# EAGLE design piezo-preamp-tickler_V2-RevG-Breakout (EAGLE 8.5.0)

## Sheet 1 of 2
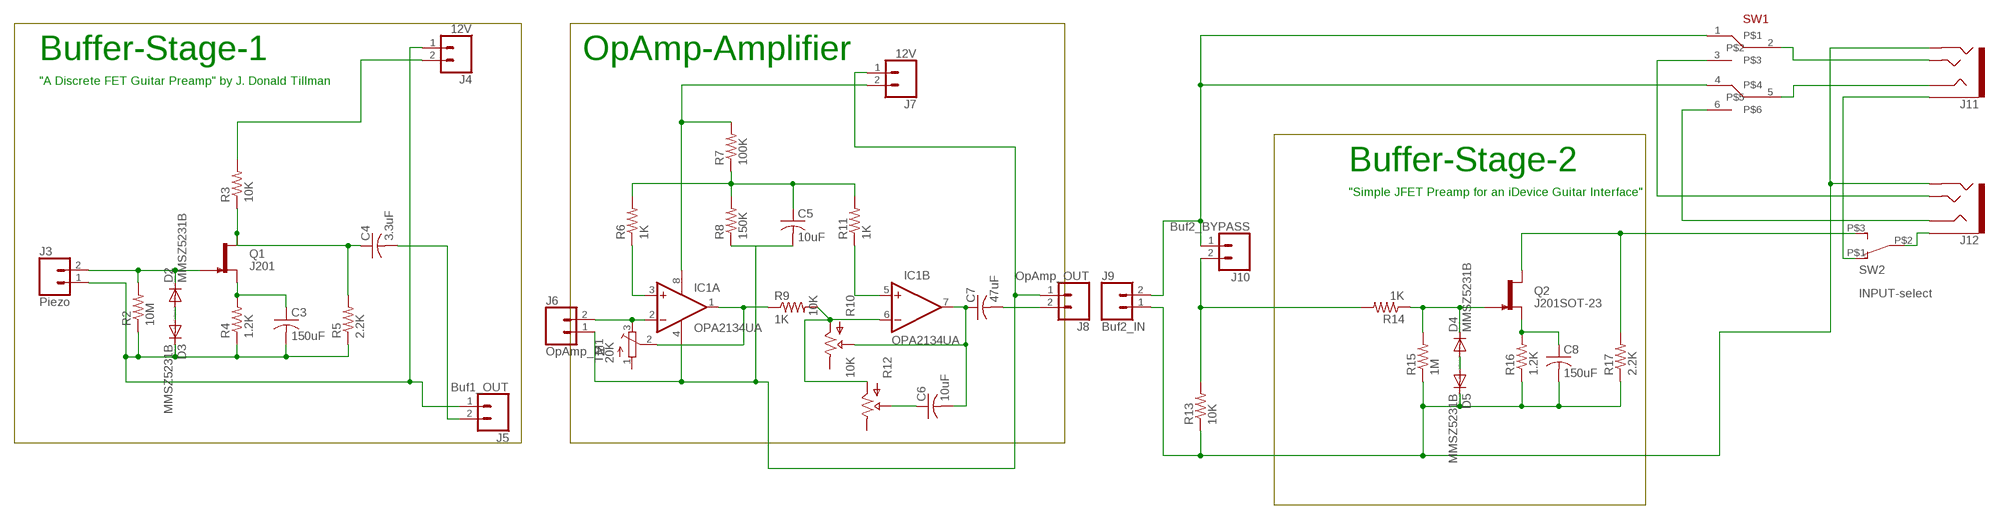
[diagram p0: schematic, sheet 1]

### Parts
C3  150uF  C-US  [CT7343]
C4  3.3uF  C-US  [CT7343]
C5  10uF  C-USC0805K  [C0805K]
C6  10uF  C-USC0805K  [C0805K]
C7  47uF  C-US  [CT7343]
C8  150uF  C-US  [CT7343]
D2  MMSZ5231B  DIODE-SOD123  [SOD123]
D3  MMSZ5231B  DIODE-SOD123  [SOD123]
D4  MMSZ5231B  DIODE-SOD123  [SOD123]
D5  MMSZ5231B  DIODE-SOD123  [SOD123]
IC1  OPA2134UA  [SO08]
J3  Piezo  CONN_02  [1X02]
J4  12V  CONN_02  [1X02]
J5  Buf1_OUT  CONN_02  [1X02]
J6  OpAmp_IN  CONN_02  [1X02]
J7  12V  CONN_02  [1X02]
J8  OpAmp_OUT  CONN_02  [1X02]
J9  Buf2_IN  CONN_02  [1X02]
J10  Buf2_BYPASS  CONN_02  [1X02]
J11  AUDIO-JACK3LGPADS  [AUDIO-JACK-TRRS-SMD]
J12  AUDIO-JACK3LGPADS  [AUDIO-JACK-TRRS-SMD]
Q1  J201  J201SOT-23  [SOT23-3]
Q2  J201SOT-23  [SOT23-3]
R2  10M  R-US_R0805  [R0805]
R3  10K  R-US_R0805  [R0805]
R4  1.2K  R-US_R0805  [R0805]
R5  2.2K  R-US_R0805  [R0805]
R6  1K  R-US_R0805  [R0805]
R7  100K  R-US_R0805  [R0805]
R8  150K  R-US_R0805  [R0805]
R9  1K  R-US_R0805  [R0805]
R10  10K  POTTHUMBPOT14  [THUMBPOT14]
R11  1K  R-US_R0805  [R0805]
R12  10K  POTTHUMBPOT14  [THUMBPOT14]
R13  10K  R-US_R0805  [R0805]
R14  1K  R-US_R0805  [R0805]
R15  1M  R-US_R0805  [R0805]
R16  1.2K  R-US_R0805  [R0805]
R17  2.2K  R-US_R0805  [R0805]
SW1  SWITCH_DPDT  [SWITCH_DPDT_CL-SB-22B]
SW2  INPUT-select  SWITCH_SPDTCL-SB-12B  [SWITCH_SPDT_CL-SB-12B]
TM1  20K  TRIMPOTTC33X  [TC33X]

### Nets
N$1: D4.A D5.A
N$2: D2.C J3.2 Q1.3(G) R2.2
N$3: C8.+ Q2.2(S) R16.2
N$5: IC1.5(B:+IN) R11.1
N$6: C6.2 C7.+ IC1.7(B:OUT) R10.P$2(WIPER)
N$7: IC1.6(B:-IN) R9.2 R10.P$1(IN) R12.P$1(IN)
N$8: D2.A D3.A
N$9: C4.+ Q1.1(D) R3.1 R5.2
N$10: D4.C Q2.3(G) R14.1 R15.2
N$11: J9.2 J10.1 SW1.1 SW1.4
N$12: J11.EARTH SW2.P$1
N$13: J11.TIP SW1.2
N$14: C3.+ Q1.2(S) R4.2
N$15: J11.RING1 SW1.5
N$17: J12.EARTH SW2.P$2
N$19: IC1.2(A:-IN) J6.2 TM1.3(E)
N$20: C3.- D3.C J3.1 J4.1 J5.1 R2.1 R4.1 R5.1
N$22: IC1.3(A:+IN) R6.1
N$23: C5.1 R6.2 R7.1 R8.2 R11.2
N$24: IC1.1(A:OUT) R9.1 TM1.2(S)
N$25: J4.2 R3.2
N$26: J12.RING1 SW1.6
N$27: J12.TIP SW1.3
N$28: C4.- J5.2
N$31: C6.1 R12.P$2(WIPER)
N$36: C7.- J8.2
N$42: IC1.8(A:V+) J7.2 R7.2
N$44: C5.2 IC1.4(A:V-) J6.1 J7.1 J8.1 R8.1
N$45: C8.- D5.C J9.1 J11.RING2 J12.RING2 R13.1 R15.1 R16.1 R17.1
N$46: J10.2 R13.2 R14.2
SELECT: Q2.1(D) R17.2 SW2.P$3
Unconnected: R10.P$3(OUT) R12.P$3(OUT) TM1.1(A)

### Notes on the sheet
- Buffer-Stage-1 | OpAmp-Amplifier
- "A Discrete FET Guitar Preamp" by J. Donald Tillman
- Buffer-Stage-2
- "Simple JFET Preamp for an iDevice Guitar Interface"

## Sheet 2 of 2
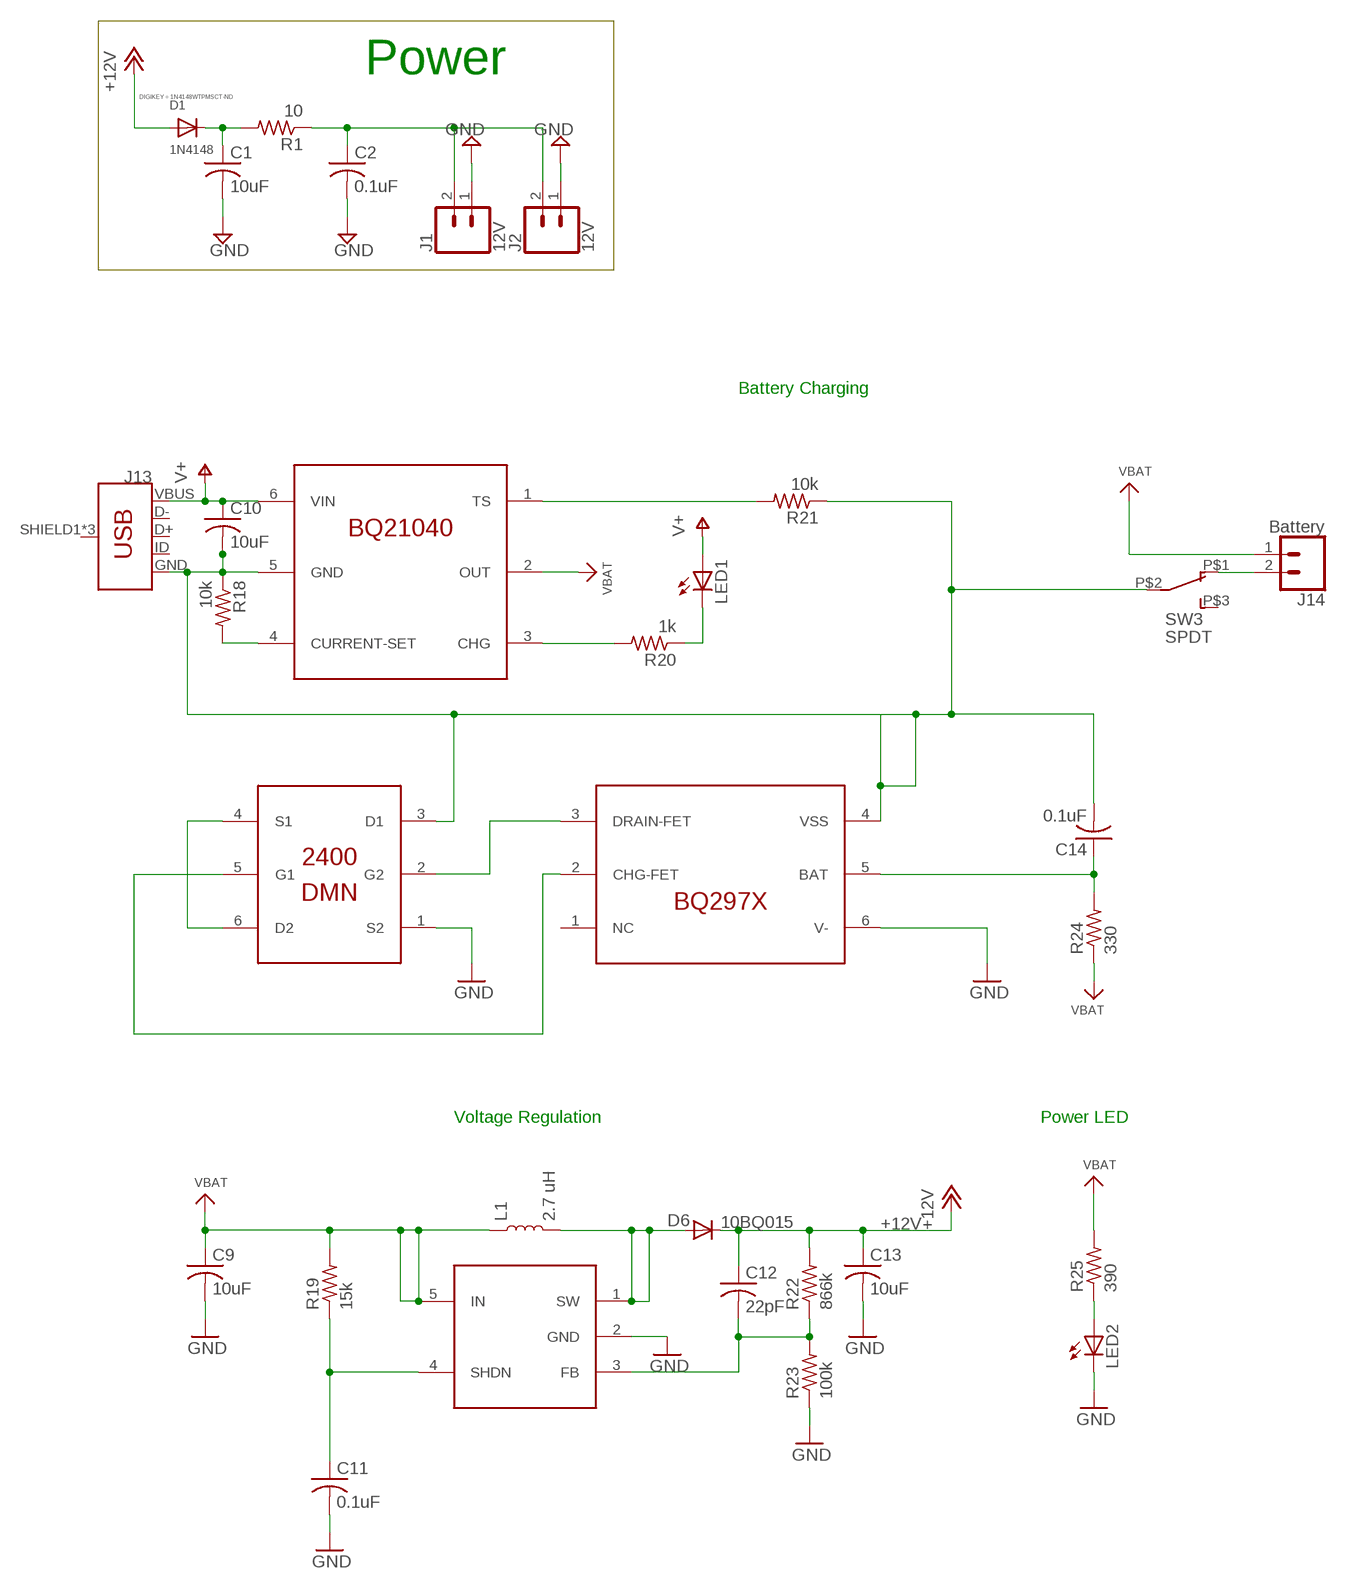
[diagram p1: schematic, sheet 2]

### Parts
C1  10uF  C-USC0805K  [C0805K]
C2  0.1uF  C-USC0805K  [C0805K]
C9  10uF  C-USC0805K  [C0805K]
C10  10uF  C-USC0805K  [C0805K]
C11  0.1uF  C-USC0805K  [C0805K]
C12  22pF  C-USC0805K  [C0805K]
C13  10uF  C-USC0805K  [C0805K]
C14  0.1uF  C-USC0805K  [C0805K]
D1  1N4148  DIODESOD-123  [SOD-123]
D6  10BQ015  DIODESMA  [SMA-DIODE]
J1  12V  CONN_02  [1X02]
J2  12V  CONN_02  [1X02]
J13  USB_MICRO-BREDUCED_PASTE  [USB-B-MICRO-SMD_RED_PASTE]
J14  Battery  CONN_02LOCK  [1X02_LOCK]
L1  2.7 uH  INDUCTOR-CR54-3.3UH  [CR54]
LED1  LED3MM  [LED3MM]
LED2  LED3MM  [LED3MM]
Q3  DMN2400  DUAL-NFET-DMN2400  [SOT-563]
Q4  BQ21040  BQ21040-LIPO-CHARGER  [SOT23-6]
Q5  SC4503  [SOT23-5]
Q6  BQ297X  BQ297X-BATTERY-MANAGER  [WSON-6]
R1  10  R-US_R0805  [R0805]
R18  10k  R-US_R0805  [R0805]
R19  15k  R-US_R0805  [R0805]
R20  1k  R-US_R0805  [R0805]
R21  10k  R-US_R0805  [R0805]
R22  866k  R-US_R0805  [R0805]
R23  100k  R-US_R0805  [R0805]
R24  330  R-US_R0805  [R0805]
R25  390  R-US_R0805  [R0805]
SW3  SPDT  SWITCH_SPDTCL-SB-12B  [SWITCH_SPDT_CL-SB-12B]

### Nets
+12V: C12.1 C13.1 D1.A D6.C R22.2
GND: C1.2 C2.2 C9.2 C11.2 C13.2 J1.1 J2.1 LED2.K(C) Q3.1(S2) Q5.2(GND) Q6.6(V-) R23.1
GND1: C10.2 C14.2 J13.GND Q3.3(D1) Q4.5(GND) Q6.4(VSS) R18.1 R21.1 SW3.P$2
N$16: C1.1 D1.C R1.2
N$18: LED2.A R25.1
N$21: J14.2 SW3.P$1
N$29: C11.1 Q5.4(SHDN) R19.1
N$30: C12.2 Q5.3(FB) R22.1 R23.2
N$32: D6.A L1.P$2 Q5.1(SW)
N$33: Q4.3(CHG) R20.2
N$34: C14.1 Q6.5(BAT) R24.2
N$35: Q4.1(TS) R21.2
N$37: Q3.4(S1) Q3.6(D2)
N$38: Q4.4(CURRENT-SET) R18.2
N$39: Q3.5(G1) Q6.2(CHG-FET)
N$40: LED1.K(C) R20.1
N$41: Q3.2(G2) Q6.3(DRAIN-FET)
N$43: C2.1 J1.2 J2.2 R1.1
V+: C10.1 J13.VBUS LED1.A Q4.6(VIN)
VBAT: C9.1 J14.1 L1.P$1 Q4.2(OUT) Q5.5(IN) R19.2 R24.1 R25.2
Unconnected: J13.D+ J13.D- J13.ID J13.SHIELD1(SHIELD) J13.SHIELD2(SHIELD) J13.SHIELD3(SHIELD) Q6.1(NC) SW3.P$3

### Notes on the sheet
- Power
- Battery Charging
- Voltage Regulation | Power LED

## Library data of the parts
C1-C14 = adafruit:C-US: CAPACITOR, American symbol
D1 = adafruit:DIODE: Diode; DIGIKEY: 1N4148WTPMSCT-ND
D2-D5 = diode:DIODE-: DIODE
D6 = SparkFun:DIODE: Diode
IC1 = linear:OPA2*: Dual Operational Amplifier Low Power, Single-Supply, Rail-To-Rail Operational Amplifier Source: http://focus.ti.com/lit/ds/symlink/opa2345.pdf http://focus.ti.com .. opa241.pdf http://focus.ti.com/lit/ds/symlink/opa2134.pdf
J1-J10 J14 = SparkFun-Connectors:CONN_02: Multi connection point. Often used as Generic Header-pin footprint for 0.1 inch spaced/style header connections On any of the 0.1 inch spaced packages, you can populate with these: Break Away Headers - Straight <https://www.sparkfun.com/products/116> (PRT-00116) Break Away Male Headers - Right Angle <https://www.sparkfun.com/products/553> (PRT-00553) Female Headers <https://www.sparkfun.com/products/115> (PRT-00115) Break Away Headers - Machine Pin <https://www.sparkfun.com/products/117> (PRT-00117) Break Away Female Headers - Swiss Machine Pin <https://www.sparkfun.com/products/743> (PRT-00743) For SCREWTERMINALS and SPRING TERMINALS visit here: Screw Terimnals on SparkFun.com <https://www.sparkfun.com/search/results?term=Screw+Terminals> (5mm/3.5mm/2.54mm spacing) This device is also useful as a general connection point to wire up your design to another part of your project. Our various solder wires solder well into these plated through hole pads. Hook-Up Wire - Assortment (Stranded, 22 AWG) <https://www.sparkfun.com/products/11375> (PRT-11375) Hook-Up Wire - Assortment (Solid Core, 22 AWG) <https://www.sparkfun.com/products/11367> (PRT-11367) View the entire wire category on our website here <https://www.sparkfun.com/categories/141> Special notes: Molex polarized connector foot print use with: PRT-08233 with associated crimp pins and housings. 2.54_SCREWTERM for use with PRT-10571. 3.5mm Screw Terminal footprints for PRT-08084 5mm Screw Terminal footprints for use with PRT-08432
J11 J12 = Daniel:AUDIO-JACK3: Audio jack - 3.5mm TRRS variety - two rings.
J13 = SparkFun-Connectors:USB_MICRO-B: USB Type Micro-B Connector Male/female and PTH/SMT variants SparkFun Products: SparkFun microB USB Breakout <https://www.sparkfun.com/products/12035> SparkFun USB microB Plug Breakout <https://www.sparkfun.com/products/10031> SparkFun ESP8266 Thing <https://www.sparkfun.com/products/13231>; PROD_ID: CONN-11752
L1 = SparkFun-Coils:INDUCTOR: Inductors Resist changes in electrical current. Basically a coil of wire. SparkFun Products: SparkFun Load Cell Amplifier - HX711 <https://www.sparkfun.com/products/13879> IOIO-OTG - V2.2 <https://www.sparkfun.com/products/13613>; PROD_ID: NDUC-11157; VALUE: 3.3µH/±30%/3.4A
LED1 LED2 = led:LED: LED OSRAM: - CHIPLED LG R971, LG N971, LY N971, LG Q971, LY Q971, LO R971, LY R971 LH N974, LH R974 LS Q976, LO Q976, LY Q976 LO Q996 - Hyper CHIPLED LW Q18S LB Q993, LB Q99A, LB R99A - SideLED LS A670, LO A670, LY A670, LG A670, LP A670 LB A673, LV A673, LT A673, LW A673 LH A674 LY A675 LS A676, LA A676, LO A676, LY A676, LW A676 LS A679, LY A679, LG A679 - Hyper Micro SIDELED® LS Y876, LA Y876, LO Y876, LY Y876 LT Y87S - SmartLED LW L88C, LW L88S LB L89C, LB L89S, LG L890 LS L89K, LO L89K, LY L89K LS L896, LA L896, LO L896, LY L896 - TOPLED LS T670, LO T670, LY T670, LG T670, LP T670 LSG T670, LSP T670, LSY T670, LOP T670, LYG T670 LG T671, LOG T671, LSG T671 LB T673, LV T673, LT T673, LW T673 LH T674 LS T676, LA T676, LO T676, LY T676, LB T676, LH T676, LSB T676, LW T676 LB T67C, LV T67C, LT T67C, LS T67K, LO T67K, LY T67K, LW E67C LS E67B, LA E67B, LO E67B, LY E67B, LB E67C, LV E67C, LT E67C LW T67C LS T679, LY T679, LG T679 LS T770, LO T770, LY T770, LG T770, LP T770 LB T773, LV T773, LT T773, LW T773 LH T774 LS E675, LA E675, LY E675, LS T675 LS T776, LA T776, LO T776, LY T776, LB T776 LHGB T686 LT T68C, LB T68C - Hyper Mini TOPLED® LB M676 - Mini TOPLED Santana® LG M470 LS M47K, LO M47K, LY M47K Source: http://www.osram.convergy.de LUXEON: - LUMILED® LXK2-PW12-R00, LXK2-PW12-S00, LXK2-PW14-U00, LXK2-PW14-V00 LXK2-PM12-R00, LXK2-PM12-S00, LXK2-PM14-U00 LXK2-PE12-Q00, LXK2-PE12-R00, LXK2-PE12-S00, LXK2-PE14-T00, LXK2-PE14-U00 LXK2-PB12-K00, LXK2-PB12-L00, LXK2-PB12-M00, LXK2-PB14-N00, LXK2-PB14-P00, LXK2-PB14-Q00 LXK2-PR12-L00, LXK2-PR12-M00, LXK2-PR14-Q00, LXK2-PR14-R00 LXK2-PD12-Q00, LXK2-PD12-R00, LXK2-PD12-S00 LXK2-PH12-R00, LXK2-PH12-S00 LXK2-PL12-P00, LXK2-PL12-Q00, LXK2-PL12-R00 Source: www.luxeon.com KINGBRIGHT: KA-3528ASYC Source: www.kingbright.com
Q1 Q2 = CMU-ArtFab:J201: N-channel JFET
Q3 = CMU-ArtFab:DUAL-NFET-DMN2400
Q4 = CMU-ArtFab:BQ21040-LIPO-CHARGER
Q5 = CMU-ArtFab:SC4503
Q6 = CMU-ArtFab:BQ297X-BATTERY-MANAGER
R1-R9 R11 R13-R25 = CMU-ArtFab:R-US_: RESISTOR, American symbol
R10 R12 = CMU-ArtFab:POT: http://www.taydaelectronics.com/10k-ohm-linear-taper-potentiometer-round-shaft-pcb-9mm.html http://www.taydaelectronics.com/datasheets/A-1847.pdf
SW1 = CMU-ArtFab:SWITCH_DPDT
SW2 SW3 = CMU-ArtFab:SWITCH_SPDT
TM1 = adafruit:TRIMPOT: SMT trimmer potentiometer part number TC33X http://www.ladyada.net/library/eagle

## Board
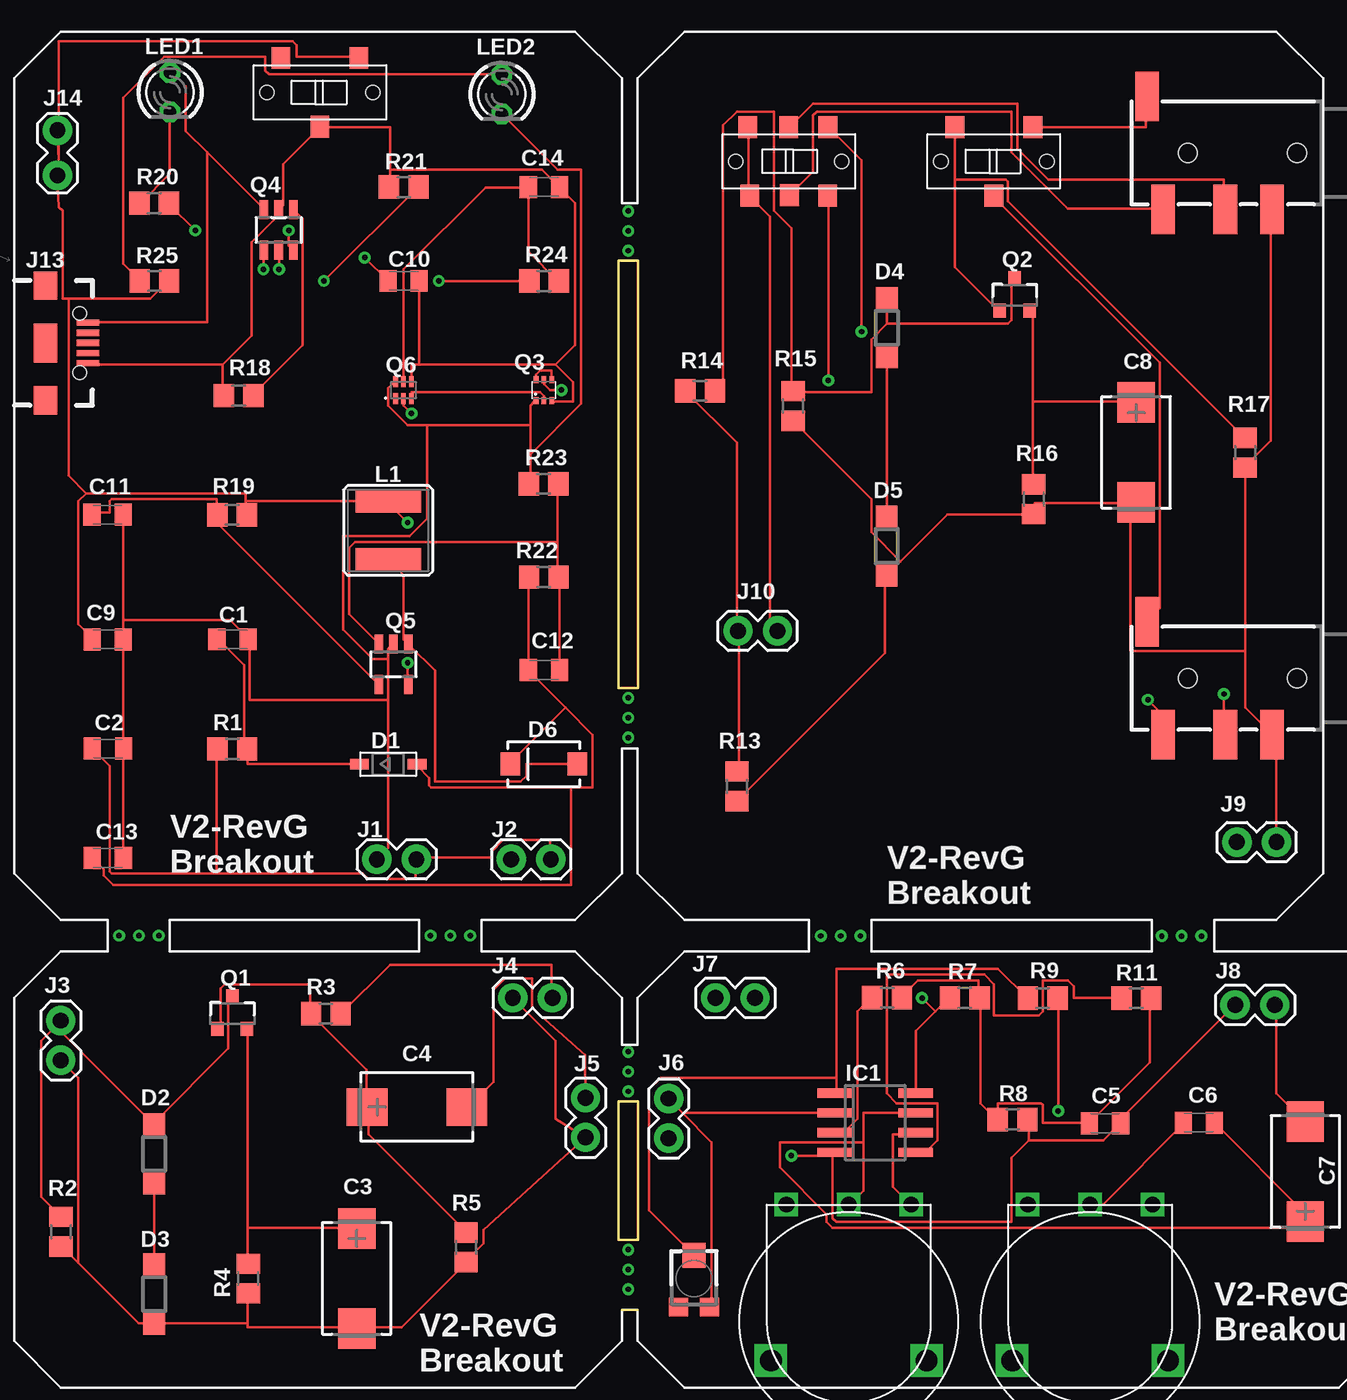
[diagram p2: board, top side]
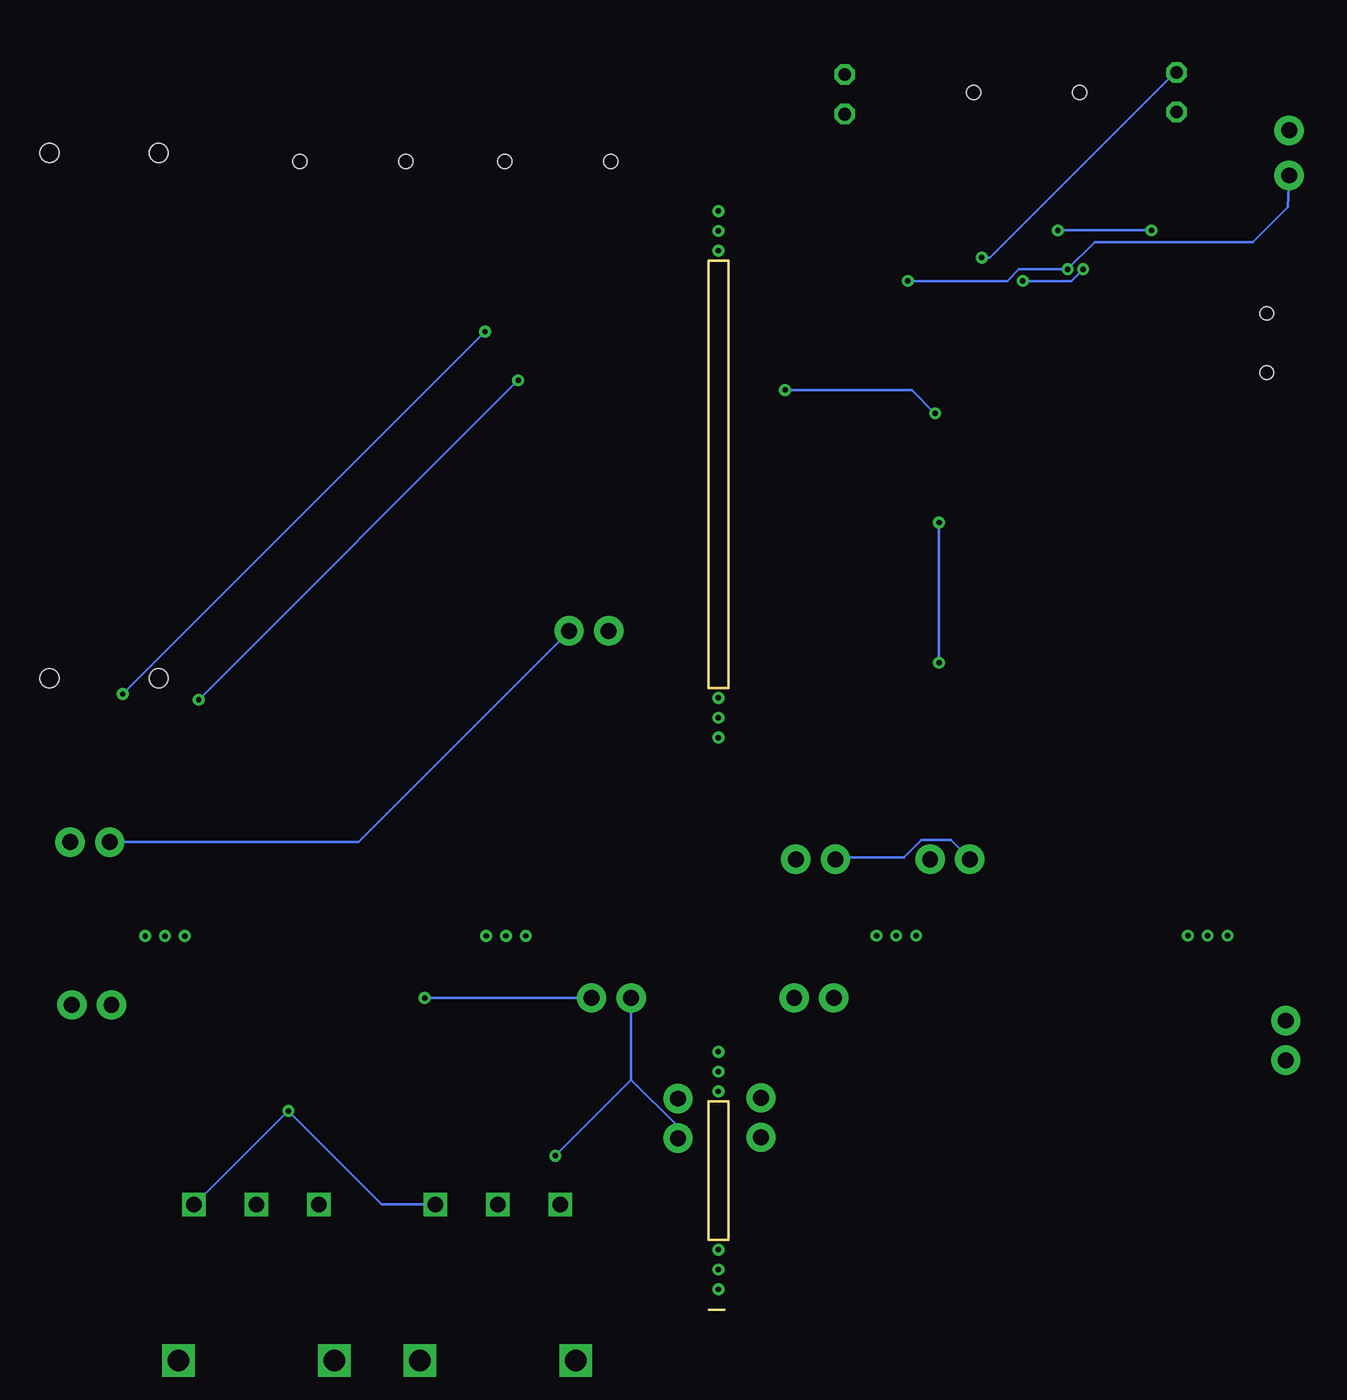
[diagram p3: board, bottom side, seen from below]

Size 1.27 x 67.32 mm. Coordinates in mm from the lower left corner, seen from the top.
Outline: 0.23,0 1.23,0.01
Outline: 0,67.32 1.27,67.32 1.27,39.89 0,39.89 0,67.32
Outline: 0,13.38 1.27,13.38 1.27,4.49 0,4.49 0,13.38
Copper layers (1*16): Top 0.035mm / dielectric 1.5mm / Bottom 0.035mm
Design rules "default *": minimum track width 6mil, minimum drill 0.35mm, track to track 8mil, track to pad 8mil, pad to pad 8mil, via to via 8mil, smd to smd 8mil, copper to edge 8mil, drill to drill 6mil, minimum pad ring 10mil, minimum via ring 8mil, stop-mask expansion 4mil, vias tented up to drill 20mil, thermal gap 10mil

### Footprints (pad centres in the part's own frame; a part is rotated, then mirrored left to right if it is on the bottom)
C0805K = smd 1.1 x 1.4: 1 -1,0; 2 1,0
CT7343 = smd 2.6 x 2.4: + 3.2,0; - -3.2,0
SOD-123 = smd 1.2 x 0.7: A 1.85,0; C -1.85,0
SOD123 = smd 1.4 x 1.4: A 1.9,0; C -1.9,0
SMA-DIODE = smd 1.27 x 1.47: A -2.15,0; C 2.15,0
SO08 = smd 0.6 x 2.2: 1 -1.905,-2.6; 2 -0.635,-2.6; 3 0.635,-2.6; 4 1.905,-2.6; 5 1.905,2.6; 6 0.635,2.6; 7 -0.635,2.6; 8 -1.905,2.6
1X02 = drill 1.016 pad 1.88: 1 0,0; 2 2.54,0
AUDIO-JACK-TRRS-SMD = smd 1.524 x 3.175: EARTH 11.227,-3.619; RING1 6.2,3.619; RING2 3.2,3.619; TIP 10.2,3.619 | hole 1.2: 1.6,0; 8.6,0
USB-B-MICRO-SMD_RED_PASTE = smd 1.45 x 0.4: D+ 2.725,0; D- 2.725,0.65; GND 2.725,-1.3; ID 2.725,-0.65; VBUS 2.725,1.3 | smd 1.5 x 1.8: SHIELD1 0,3.685; SHIELD2 0,-3.685 | smd 1.5 x 2.5: SHIELD3 0,0 | hole 0.85: 2.2,1.9; 2.2,-1.9
1X02_LOCK = drill 1.016 pad 1.88: 1 -0.178,0; 2 2.718,0
CR54 = smd 4.2 x 1.4: P$1 0,1.85; P$2 0,-1.85
LED3MM = drill 0.813 octagon: A -1.27,0; K 1.27,0
SOT23-3 = smd 0.8 x 0.9: 1 -0.95,-1; 2 0.95,-1; 3 0,1.1
SOT-563 = smd 0.3 x 0.45: 1 -0.5,-0.675; 2 0,-0.675; 3 0.5,-0.675; 4 0.5,0.675; 5 0,0.675; 6 -0.5,0.675
SOT23-6 = smd 0.55 x 1.2: 1 -0.95,-1.3; 2 0,-1.3; 3 0.95,-1.3; 4 0.95,1.3; 5 0,1.3; 6 -0.95,1.3
SOT23-5 = smd 0.55 x 1.2: 1 -0.95,-1.3; 2 0,-1.3; 3 0.95,-1.3; 4 0.95,1.3; 5 -0.95,1.3
WSON-6 = smd 0.3 x 0.7: 1 -0.5,-0.55; 2 0,-0.55; 3 0.5,-0.55; 4 0.5,0.55; 5 0,0.55; 6 -0.5,0.55
R0805 = smd 1.3 x 1.5: 1 -0.95,0; 2 0.95,0
THUMBPOT14 = drill 1 square: P$1 -4,-7.5; P$2 0,-7.5; P$3 4,-7.5 | drill 1.4 square: P$4 -5,2.5; P$5 5,2.5
SWITCH_DPDT_CL-SB-22B = smd 1.2 x 1.4: 1 -2.5,-2.2; 2 0.05,-2.17; 3 2.5,-2.2; 4 -2.63,2.2; 5 0,2.2; 6 2.51,2.2 | hole 0.9: -3.4,0; 3.4,0
SWITCH_SPDT_CL-SB-12B = smd 1.2 x 1.4: P$1 -2.5,-2.2; P$2 0,2.2; P$3 2.5,-2.2 | hole 0.9: -3.4,0; 3.4,0
TC33X = smd 1.2 x 1.2: 1 -1,-1.825; 3 1,-1.825 | smd 1.5 x 1.6: 2 0,1.5

### Placement (x,y rotation side)
C1  -24.76,43.02 0 top  (outside the outline)
C2  -32.75,36 0 top  (outside the outline)
C3  -16.78,2.01 90 top  (outside the outline)
C4  -12.92,13.01 180 top  (outside the outline)
C5  31.23,11.96 0 top  (outside the outline)
C6  37.24,12 0 top  (outside the outline)
C7  44.07,8.88 270 top  (outside the outline)
C8  33.23,55.01 90 top  (outside the outline)
C9  -32.77,43.02 0 top  (outside the outline)
C10  -13.78,66.02 0 top  (outside the outline)
C11  -32.78,51.02 0 top  (outside the outline)
C12  -4.78,41.04 0 top  (outside the outline)
C13  -32.76,28.99 0 top  (outside the outline)
C14  -4.78,72.04 0 top  (outside the outline)
D1  -14.77,35 0 top  (outside the outline)
D2  -29.78,10.01 270 top  (outside the outline)
D3  -29.77,1.01 90 top  (outside the outline)
D4  17.23,63 270 top  (outside the outline)
D5  17.22,49 90 top  (outside the outline)
D6  -4.78,35.01 180 top
IC1  16.47,12.01 270 top  (outside the outline)
J1  -15.5,28.91 0 top  (outside the outline)
J2  -6.88,28.91 0 top  (outside the outline)
J3  -35.77,16.01 90 top  (outside the outline)
J4  -6.77,20.01 0 top  (outside the outline)
J5  -2.1,11.06 90 top
J6  3.23,11.01 90 top
J7  6.23,20.01 0 top  (outside the outline)
J8  39.58,19.56 0 top  (outside the outline)
J9  42.23,30.01 180 top  (outside the outline)
J10  10.21,43.56 180 top  (outside the outline)
J11  45.15,74.23 180 top  (outside the outline)
J12  45.15,40.52 180 top  (outside the outline)
J13  -36.76,62.04 0 top  (outside the outline)
J14  -35.98,72.95 90 top  (outside the outline)
L1  -14.77,50.01 0 top  (outside the outline)
LED1  -28.77,78.12 270 top  (outside the outline)
LED2  -7.48,77.98 270 top  (outside the outline)
Q1  -24.77,19.01 0 top  (outside the outline)
Q2  25.42,65.09 0 top  (outside the outline)
Q3  -4.78,59 0 top  (outside the outline)
Q4  -21.8,69.29 0 top  (outside the outline)
Q5  -14.43,41.41 180 top  (outside the outline)
Q6  -13.79,59 0 top  (outside the outline)
R1  -24.77,35.98 0 top  (outside the outline)
R2  -35.76,5.01 90 top  (outside the outline)
R3  -18.76,19 0 top  (outside the outline)
R4  -23.74,2 90 top  (outside the outline)
R5  -9.77,4.01 90 top  (outside the outline)
R6  17.24,20.03 0 top  (outside the outline)
R7  22.22,20.01 180 top  (outside the outline)
R8  25.29,12.21 180 top  (outside the outline)
R9  27.23,20 0 top  (outside the outline)
R10  14.78,-0.75 180 top  (outside the outline)
R11  33.23,20 0 top  (outside the outline)
R12  30.27,-0.75 180 top  (outside the outline)
R13  7.61,33.59 90 top  (outside the outline)
R14  5.25,58.96 180 top  (outside the outline)
R15  11.21,57.99 90 top  (outside the outline)
R16  26.66,52.01 90 top  (outside the outline)
R17  40.22,54.99 90 top  (outside the outline)
R18  -24.36,58.66 0 top  (outside the outline)
R19  -24.78,51 0 top  (outside the outline)
R20  -29.78,71.01 0 top  (outside the outline)
R21  -13.77,72.04 0 top  (outside the outline)
R22  -4.79,47.02 180 top  (outside the outline)
R23  -4.8,52.99 0 top  (outside the outline)
R24  -4.77,66.01 0 top  (outside the outline)
R25  -29.77,66.02 0 top  (outside the outline)
SW1  10.93,73.69 0 top  (outside the outline)
SW2  24.09,73.69 180 top  (outside the outline)
SW3  -19.15,78.12 180 top  (outside the outline)
TM1  4.85,2 0 top

### Tracks (layer width: path | path; a pad name or v marks a point on that pad's centre or on a via)
+12V
  Top 0.152: -3.02,33.51 -1.65,33.51 -1.65,36.88 -3.4,38.63 | -3.02,33.51 -12.02,33.51 -12.15,33.63 -12.15,34.13 -12.9,34.88 D1.A | -3.4,38.63 -5.77,41.01 C12.1 -5.77,41.13 -5.77,47.01 R22.2 | C13.1 -33.02,28.26 -33.02,27.88 -32.4,27.26 -3.02,27.26 -3.02,33.51 | -3.4,38.63 -6.9,35.13 D6.C
GND
  Top 0.152: -5.65,54.88 -5.65,53.01 R23.1 | -5.65,54.88 -5.65,56.76 | -5.65,56.76 -5.65,58.01 -5.4,58.26 Q3.1 | -5.65,56.76 -12.27,56.76 | -12.27,56.76 -13.52,56.76 -14.77,58.01 -14.77,59.13 -14.4,59.51 Q6.6 | LED2.K -3.9,73.14 -2.4,73.14 -2.4,58.13 -5.65,54.88 | -14.77,39.13 -14.77,29.63 -15.4,29.01 J1.1 | -14.77,39.13 -14.77,41.76 | -14.77,41.76 -14.77,42.38 -14.52,42.63 Q5.2 | C13.2 -31.77,29.01 -31.77,35.88 C2.2 -31.77,36.01 C9.2 -31.77,43.13 -31.77,44.26 | -31.77,44.26 C11.2 | -31.77,44.26 -24.9,44.26 -23.77,43.13 C1.2 -23.65,43.01 -23.65,39.13 -14.77,39.13 | -12.27,56.76 -12.27,50.76 -13.4,49.63 -17.65,49.63 -17.65,43.63 -15.77,41.76 -14.77,41.76
  Bottom 0.152: J2.1 -6.9,29.01 -11.27,29.01 -12.4,30.13 -14.27,30.13 -15.4,29.01 J1.1
GND1
  Top 0.152: -4.02,60.63 -2.9,59.51 -2.9,58.26 -4.27,58.26 Q3.3 | -12.77,60.63 -13.27,60.63 -13.27,59.63 Q6.4 | -12.77,60.63 -4.02,60.63 | -12.77,60.63 C10.2 | -25.4,60.63 -34.02,60.63 J13.GND | -25.4,60.63 -25.4,58.76 R18.1 | -19.15,75.89 -21.52,73.51 -21.52,70.89 -21.77,70.64 Q4.5 -21.9,70.51 -21.9,70.14 -23.52,68.51 -23.52,62.51 -25.4,60.63 | -14.65,73.14 -4.9,73.14 -3.9,72.14 C14.2 -3.77,72.01 -2.77,71.01 -2.77,61.88 -4.02,60.63 | -14.65,73.14 -14.65,72.14 R21.1 | -19.15,75.89 -14.65,75.89 -14.65,73.14 | -19.15,75.89 SW3.P$2
N$1
  Top 0.152: D5.A 17.23,51.01 17.23,61.01 D4.A
N$2
  Top 0.152: Q1.3 -24.9,20.01 -25.02,19.88 -25.02,16.76 -29.77,12.01 D2.C -29.9,12.01 -36.02,18.13 -36.02,18.26 | -36.02,18.26 -35.77,18.51 J3.2 -36.02,18.26 | -36.02,18.26 -37.02,17.26 -37.02,7.26 -35.77,6.01 R2.2
N$3
  Top 0.152: 26.6,58.26 26.6,53.01 R16.2 | 26.6,58.26 26.6,63.88 26.48,64.01 Q2.2 | 26.6,58.26 33.23,58.26 C8.+
N$5
  Top 0.152: R11.1 32.23,20.01 29.23,20.01 29.23,20.76 28.85,21.13 27.23,21.13 27.23,19.13 26.98,18.88 24.1,18.88 24.1,20.88 23.48,21.51 17.23,21.51 17.23,13.88 17.85,13.26 20.48,13.26 20.48,10.88 19.73,10.13 19.1,10.13 IC1.5
N$6
  Top 0.152: 15.73,10.76 15.73,7.63 14.85,6.76 R10.P$2 | 15.73,10.76 15.73,12.63 18.98,12.63 IC1.7 | C6.2 38.35,11.88 43.98,6.26 43.98,5.76 C7.+ 43.98,5.63 43.98,5.26 13.73,5.26 13.35,5.63 13.35,6.13 10.35,9.13 10.35,10.76 15.73,10.76
N$7  (via drill 0.35)
  Top 0.152: IC1.6 18.98,11.26 17.6,11.26 17.6,7.88 18.73,6.76 R10.P$1 | v28.23,12.76 28.23,19.88 R9.2
  Bottom 0.152: R12.P$1 34.23,6.76 v28.23,12.76 22.23,6.76 18.85,6.76 R10.P$1
N$8
  Top 0.152: D3.A -29.77,8.01 D2.A
N$9
  Top 0.152: Q1.1 -25.65,18.13 -25.52,18.26 -25.52,20.63 -25.27,20.88 -19.77,20.88 -19.77,19.01 R3.1 -19.65,18.88 -16.15,15.38 -16.15,13.01 C4.+ -16.02,12.88 -16.02,11.26 -9.77,5.01 R5.2
N$10
  Top 0.152: 17.23,63.26 24.98,63.26 25.23,63.51 25.23,66.01 25.35,66.14 Q2.3 | 17.23,63.26 17.23,64.89 D4.C | 17.23,63.26 16.23,62.26 16.23,58.88 11.23,58.88 R15.2 11.1,59.01 11.1,69.39 9.98,70.51 9.98,76.89 7.6,76.89 6.73,76.01 6.73,59.51 6.23,59.01 R14.1
N$11
  Top 0.152: SW1.4 8.35,75.89 8.35,71.51 SW1.1 8.48,71.39 9.73,70.14 9.73,44.01 10.1,43.63 J10.1
  Bottom 0.152: J9.2 23.73,30.01 10.23,43.51 J10.1
N$12
  Top 0.152: SW2.P$1 33.85,75.89 33.85,77.76 J11.EARTH
N$13
  Top 0.152: SW1.2 12.48,73.01 12.48,76.64 12.73,76.89 25.23,76.89 25.23,74.26 28.85,70.64 34.85,70.64 J11.TIP
N$14
  Top 0.152: -23.77,5.26 -23.77,3.01 R4.2 | -23.77,5.26 -23.77,18.01 Q1.2 | -23.77,5.26 -16.9,5.26 C3.+
N$15
  Top 0.152: SW1.5 10.98,75.89 12.48,77.39 25.6,77.39 25.6,74.51 27.6,72.51 38.85,72.51 38.85,70.64 J11.RING1
N$16
  Top 0.152: D1.C -16.65,35.01 -23.77,35.01 -23.77,35.88 R1.2 -23.9,36.01 -24.02,36.13 -24.02,41.38 -25.65,43.01 C1.1
N$17
  Top 0.152: SW2.P$2 24.1,71.39 34.73,60.76 34.73,45.01 33.98,44.26 J12.EARTH
N$18
  Top 0.152: R25.1 -30.77,66.14 -31.77,67.14 -31.77,77.76 -29.15,80.39 -22.65,80.39 -22.65,79.51 -22.4,79.26 -7.52,79.26 LED2.A
N$19
  Top 0.152: 4.1,12.63 3.23,13.51 J6.2 | 4.1,12.63 5.98,10.76 5.98,0.38 5.85,0.26 TM1.3 | 4.1,12.63 13.85,12.63 IC1.2
N$20
  Top 0.152: J4.1 -4.02,17.26 -4.02,12.26 J5.1 -8.65,5.13 -8.65,4.26 -9.77,3.13 R5.1 -9.77,3.01 -13.9,-1.12 -16.77,-1.12 C3.- -16.9,-1.12 -23.77,-1.12 -23.77,-0.87 | -23.77,-0.87 -29.77,-0.87 | -23.77,-0.87 -23.77,1.01 R4.1 | -34.65,3.01 -30.77,-0.87 -29.77,-0.87 | -34.65,3.01 -35.65,4.01 R2.1 | -29.77,-0.87 D3.C | J3.1 -34.65,14.88 -34.65,3.01
N$21
  Top 0.152: SW3.P$1 -16.65,80.39 -20.65,80.39 -20.65,81.14 -20.9,81.39 -35.9,81.39 -35.9,73.76 J14.2
N$22
  Top 0.152: R6.1 16.23,20.01 15.35,19.13 15.35,12.26 14.48,11.38 13.98,11.38 IC1.3
N$23
  Top 0.152: R11.2 34.1,19.88 34.1,15.88 30.23,12.01 C5.1 30.1,12.01 27.23,12.01 27.23,13.13 27.1,13.26 24.35,13.26 24.35,12.26 R8.2 24.23,12.26 23.23,13.26 23.23,20.01 R7.1 23.1,20.13 23.1,21.13 19.23,21.13 18.23,20.13 R6.2
N$24
  Top 0.152: 13.98,14.88 13.98,14.01 IC1.1 | 13.98,14.88 13.98,21.88 24.35,21.88 26.23,20.01 R9.1 | 13.98,14.88 2.73,14.88 1.98,14.13 1.98,6.38 TM1.2
N$25
  Top 0.152: R3.2 -17.77,19.01 -14.65,22.13 -4.27,22.13 -4.27,20.01 J4.2
N$26  (via drill 0.35)
  Top 0.152: v15.6,62.76 15.6,73.76 13.48,75.89 SW1.6 | v38.85,39.51 38.85,37.01 J12.RING1
  Bottom 0.152: v38.85,39.51 v15.6,62.76
N$27  (via drill 0.35)
  Top 0.152: v13.48,59.63 13.48,71.39 SW1.3 | v33.98,39.13 34.85,38.26 34.85,37.01 J12.TIP
  Bottom 0.152: v33.98,39.13 v13.48,59.63
N$28
  Top 0.152: J5.2 -2.13,16.37 -5.52,19.38 -5.52,21.26 -7.27,21.26 -8.02,20.51 -8.02,14.63 -9.65,13.01 C4.-
N$29
  Top 0.152: Q5.4 -15.4,40.13 -25.65,50.38 -25.65,50.88 R19.1 -25.77,51.01 -25.77,52.01 -32.52,52.01 -32.65,51.88 -32.65,51.13 -33.77,51.13 C11.1
N$30
  Top 0.152: -3.9,49.26 -16.9,49.26 -17.27,48.88 -17.27,44.63 -15.4,42.76 Q5.3 | -3.9,49.26 -3.9,47.13 R22.1 -3.77,47.01 -3.77,41.13 C12.2 | -3.9,49.26 -3.9,52.88 R23.2
N$31
  Top 0.152: C6.1 36.23,11.88 31.1,6.76 30.35,6.76 R12.P$2
N$32
  Top 0.152: L1.P$2 -14.77,48.13 -13.77,47.13 -13.77,43.01 -13.52,42.76 Q5.1 -13.4,42.63 -11.77,41.01 -11.77,33.88 -6.27,33.88 -5.9,34.26 -5.9,35.01 -2.65,35.01 D6.A
N$33  (via drill 0.35)
  Top 0.152: v-21.15,69.26 -21.15,68.26 -20.9,68.01 Q4.3 | v-27.15,69.26 -28.77,70.89 R20.2
  Bottom 0.152: v-27.15,69.26 v-21.15,69.26
N$34
  Top 0.152: Q6.5 -13.77,59.63 -13.77,66.76 -8.52,72.01 -5.9,72.01 C14.1 -5.77,72.01 -5.77,67.89 -3.9,66.01 R24.2
N$35  (via drill 0.35)
  Top 0.152: v-22.77,66.76 -22.77,67.89 Q4.1 | v-18.9,66.01 -12.9,72.01 R21.2
  Bottom 0.152: v-22.77,66.76 -22.02,66.01 v-18.9,66.01
N$36
  Top 0.152: C7.- 43.98,12.13 42.23,13.88 42.23,19.51 J8.2
N$37
  Top 0.152: Q3.6 -5.27,59.76 -5.27,60.01 -5.02,60.26 -4.27,60.26 -4.27,59.76 Q3.4
N$38
  Top 0.152: Q4.4 -20.77,70.51 -20.27,70.01 -20.27,61.88 -23.4,58.76 R18.2
N$39  (via drill 0.35)
  Top 0.152: v-3.65,59.01 -4.4,59.01 -4.77,59.38 -4.77,59.63 Q3.5 | v-13.27,57.51 -13.77,58.01 -13.77,58.38 Q6.2
  Bottom 0.152: v-3.65,59.01 -11.77,59.01 v-13.27,57.51
N$40
  Top 0.152: R20.1 -30.65,71.01 -28.77,72.89 -28.77,76.76 LED1.K
N$41
  Top 0.152: Q3.2 -4.77,58.38 -4.77,58.63 -5.02,58.88 -13.27,58.88 -13.27,58.51 Q6.3
N$42  (via drill 0.35)
  Top 0.152: 20.35,19.13 19.1,17.88 19.1,14.01 IC1.8 | 20.35,19.13 21.23,20.01 R7.2 | 20.35,19.13 v19.48,20.01
  Bottom 0.152: v19.48,20.01 J7.2
N$43
  Top 0.152: -25.77,28.01 -32.52,28.01 -32.65,28.13 -32.65,34.88 -33.65,35.88 C2.1 | -25.77,28.01 -25.77,35.88 R1.1 | J2.2 -4.4,29.01 -4.4,30.13 -7.4,30.13 -8.15,29.38 -8.15,29.01 -12.9,29.01 J1.2 -13.02,28.88 -13.02,27.63 -16.02,27.63 -16.4,28.01 -25.77,28.01
N$44  (via drill 0.35)
  Top 0.152: 26.35,10.88 31.1,10.88 32.1,11.88 C5.2 32.23,12.01 32.23,12.26 39.48,19.51 J8.1 | 26.35,10.88 26.35,12.13 R8.1 | 13.73,9.88 13.85,10.01 IC1.4 13.73,9.88 | 13.73,9.88 13.73,5.88 13.98,5.63 25.23,5.63 25.23,9.76 26.35,10.88 | 13.73,9.88 v11.1,9.88
  Bottom 0.152: J6.1 3.23,11.76 6.23,14.76 | J7.1 6.23,14.76 | v11.1,9.88 6.23,14.76
N$45
  Top 0.152: J9.1 42.23,36.63 41.98,36.88 J12.RING2 41.85,37.01 40.23,38.63 40.23,42.26 | J11.RING2 41.85,70.51 41.85,55.76 40.23,54.13 R17.1 40.23,54.01 40.23,42.26 | 18.1,48.01 21.1,51.01 26.6,51.01 R16.1 26.73,51.13 26.73,51.76 32.85,51.76 | 18.1,48.01 17.23,47.13 D5.C 17.1,47.01 17.1,42.13 7.73,32.76 R13.1 | 18.1,48.01 16.23,49.88 16.23,52.01 11.23,57.01 R15.1 | 32.85,51.76 33.23,51.76 C8.- 32.85,51.76 | 40.23,42.26 32.85,42.26 32.85,51.76
N$46
  Top 0.152: R13.2 7.73,34.63 7.73,43.51 J10.2 7.6,43.63 7.6,55.63 4.35,58.88 R14.2
N$49  (via drill 0.35)
  other vias: -32.03,24.01
N$50  (via drill 0.35)
  other vias: -30.76,24.01
N$51  (via drill 0.35)
  other vias: -29.49,24.01
N$65  (via drill 0.35)
  other vias: -12.05,24.01
N$66  (via drill 0.35)
  other vias: -10.78,24.01
N$67  (via drill 0.35)
  other vias: -9.51,24.01
N$85  (via drill 0.35)
  other vias: 12.99,23.99
N$86  (via drill 0.35)
  other vias: 14.26,23.99
N$87  (via drill 0.35)
  other vias: 15.53,23.99
N$102  (via drill 0.35)
  other vias: 36.14,23.99
N$103  (via drill 0.35)
  other vias: 34.87,23.99
N$104  (via drill 0.35)
  other vias: 37.41,23.99
N$115  (via drill 0.35)
  other vias: 0.63,1.31
N$116  (via drill 0.35)
  other vias: 0.63,2.58
N$117  (via drill 0.35)
  other vias: 0.63,3.86
N$125  (via drill 0.35)
  other vias: 0.63,14.01
N$126  (via drill 0.35)
  other vias: 0.63,15.28
N$127  (via drill 0.35)
  other vias: 0.63,16.55
N$135  (via drill 0.35)
  other vias: 0.63,36.71
N$136  (via drill 0.35)
  other vias: 0.63,37.98
N$137  (via drill 0.35)
  other vias: 0.63,39.25
N$147  (via drill 0.35)
  other vias: 0.63,67.95
N$148  (via drill 0.35)
  other vias: 0.63,69.23
N$149  (via drill 0.35)
  other vias: 0.63,70.5
SELECT
  Top 0.152: 21.6,72.51 SW2.P$3 | 21.6,72.51 21.6,66.89 24.35,64.14 Q2.1 | 21.6,72.51 24.85,72.51 24.98,72.39 24.98,71.14 40.1,56.01 R17.2
V+  (via drill 0.35)
  Top 0.152: -26.4,74.26 -27.77,75.64 -27.77,78.51 -28.65,79.39 LED1.A | -26.4,74.26 -22.77,70.64 Q4.6 | v-16.27,67.51 C10.1 | -26.4,74.26 -26.4,63.38 -34.02,63.38 J13.VBUS
  Bottom 0.152: v-16.27,67.51 -16.77,67.51 -28.65,79.39 LED1.A
VBAT  (via drill 0.35)
  Top 0.152: v-13.52,41.51 -13.52,40.13 Q5.5 | v-13.52,50.51 -14.77,51.76 L1.P$1 -14.77,51.88 -23.9,51.88 | -34.15,52.38 -34.65,51.88 -34.65,44.01 -33.77,43.13 C9.1 | -34.15,52.38 -23.9,52.38 -23.9,51.88 | -23.9,51.88 -23.9,51.01 R19.2 | v-21.77,66.76 -21.77,67.89 Q4.2 | -35.27,64.89 -35.65,64.89 -35.65,70.51 -35.9,70.76 J14.1 | -35.27,64.89 -30.02,64.89 -28.9,66.01 R25.2 | v-11.52,66.01 -5.77,66.01 R24.1 | -34.15,52.38 -35.27,53.51 -35.27,64.89
  Bottom 0.152: v-13.52,50.51 v-13.52,41.51 | J14.1 -35.9,70.76 -33.65,68.51 -23.52,68.51 v-21.77,66.76 -18.65,66.76 -17.9,66.01 v-11.52,66.01

### Text on the board
tPlace: V2-RevG / Breakout | V2-RevG / Breakout | V2-RevG / Breakout | V2-RevG / Breakout